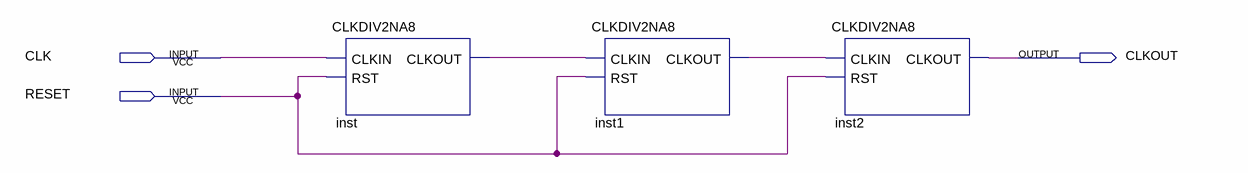
[diagram p0: schematic sheet]
// Quartus schematic LAB07.bdf as structural Verilog: 3 symbols, 3 pins
module LAB07 (
  input  CLK,
  input  RESET,
  output CLKOUT
);

  wire inst1_clkout, inst_clkout;

  CLKDIV2NA8 inst (.CLKIN(CLK), .RST(RESET), .CLKOUT(inst_clkout));
  CLKDIV2NA8 inst1 (.CLKIN(inst_clkout), .RST(RESET), .CLKOUT(inst1_clkout));
  CLKDIV2NA8 inst2 (.CLKIN(inst1_clkout), .RST(RESET), .CLKOUT(CLKOUT));
endmodule
